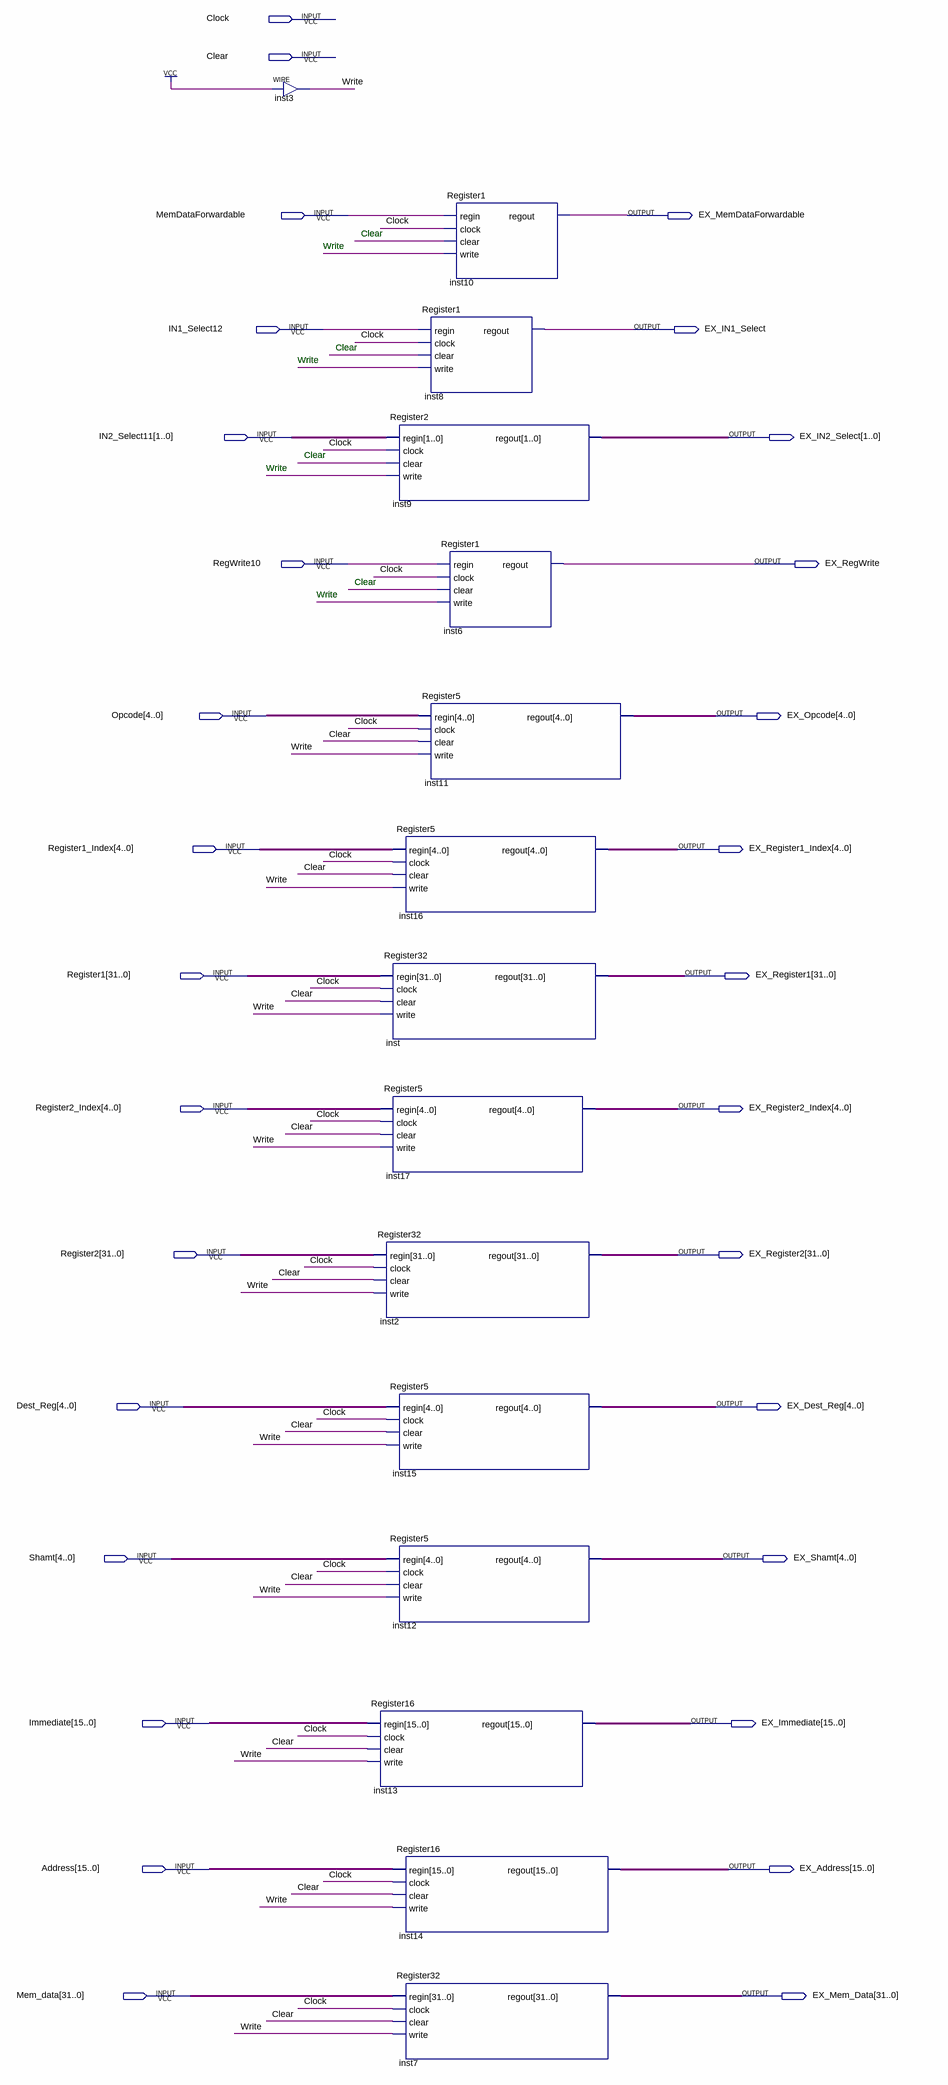
[diagram p0: schematic sheet]
// Quartus schematic MemtoEXRegs.bdf as structural Verilog: 15 symbols, 30 pins
module MemtoEXRegs (
  input  Clock,
  input  Clear,
  input  MemDataForwardable,
  input  IN1_Select12,
  input  [1:0] IN2_Select11,
  input  RegWrite10,
  input  [4:0] Opcode,
  input  [4:0] Register1_Index,
  input  [31:0] Register1,
  input  [4:0] Register2_Index,
  input  [31:0] Register2,
  input  [4:0] Dest_Reg,
  input  [4:0] Shamt,
  input  [15:0] Immediate,
  input  [15:0] Address,
  input  [31:0] Mem_data,
  output EX_MemDataForwardable,
  output EX_IN1_Select,
  output [1:0] EX_IN2_Select,
  output EX_RegWrite,
  output [4:0] EX_Opcode,
  output [4:0] EX_Register1_Index,
  output [31:0] EX_Register1,
  output [4:0] EX_Register2_Index,
  output [31:0] EX_Register2,
  output [4:0] EX_Dest_Reg,
  output [4:0] EX_Shamt,
  output [15:0] EX_Immediate,
  output [15:0] EX_Address,
  output [31:0] EX_Mem_Data
);

  wire Write;

  assign Write = 1'b1;  // WIRE inst3
  Register32 inst (.regin(Register1), .clock(Clock), .clear(Clear), .write(Write), .regout(EX_Register1));
  Register5 inst17 (.regin(Register2_Index), .clock(Clock), .clear(Clear), .write(Write), .regout(EX_Register2_Index));
  Register32 inst2 (.regin(Register2), .clock(Clock), .clear(Clear), .write(Write), .regout(EX_Register2));
  Register16 inst13 (.regin(Immediate), .clock(Clock), .clear(Clear), .write(Write), .regout(EX_Immediate));
  Register1 inst8 (.regin(IN1_Select12), .clock(Clock), .clear(Clear), .write(Write), .regout(EX_IN1_Select));
  Register2 inst9 (.regin(IN2_Select11), .clock(Clock), .clear(Clear), .write(Write), .regout(EX_IN2_Select));
  Register5 inst11 (.regin(Opcode), .clock(Clock), .clear(Clear), .write(Write), .regout(EX_Opcode));
  Register5 inst16 (.regin(Register1_Index), .clock(Clock), .clear(Clear), .write(Write), .regout(EX_Register1_Index));
  Register5 inst15 (.regin(Dest_Reg), .clock(Clock), .clear(Clear), .write(Write), .regout(EX_Dest_Reg));
  Register5 inst12 (.regin(Shamt), .clock(Clock), .clear(Clear), .write(Write), .regout(EX_Shamt));
  Register16 inst14 (.regin(Address), .clock(Clock), .clear(Clear), .write(Write), .regout(EX_Address));
  Register32 inst7 (.regin(Mem_data), .clock(Clock), .clear(Clear), .write(Write), .regout(EX_Mem_Data));
  Register1 inst10 (
    .regin(MemDataForwardable), .clock(Clock), .clear(Clear), .write(Write), .regout(EX_MemDataForwardable));
  Register1 inst6 (.regin(RegWrite10), .clock(Clock), .clear(Clear), .write(Write), .regout(EX_RegWrite));

  // Notes on the sheet:
  //   Clear
  //   Write
  //   Clear
  //   Write
  //   Clear
  //   Write
  //   Clear
  //   Write
endmodule
